# EAGLE design HFT-ArduinoShield-Module_1V1 (EAGLE 7.7.0)
Assembly variants: BAT-Charger_by_MCU

## Sheet 1 of 4: Arduino Uno socket
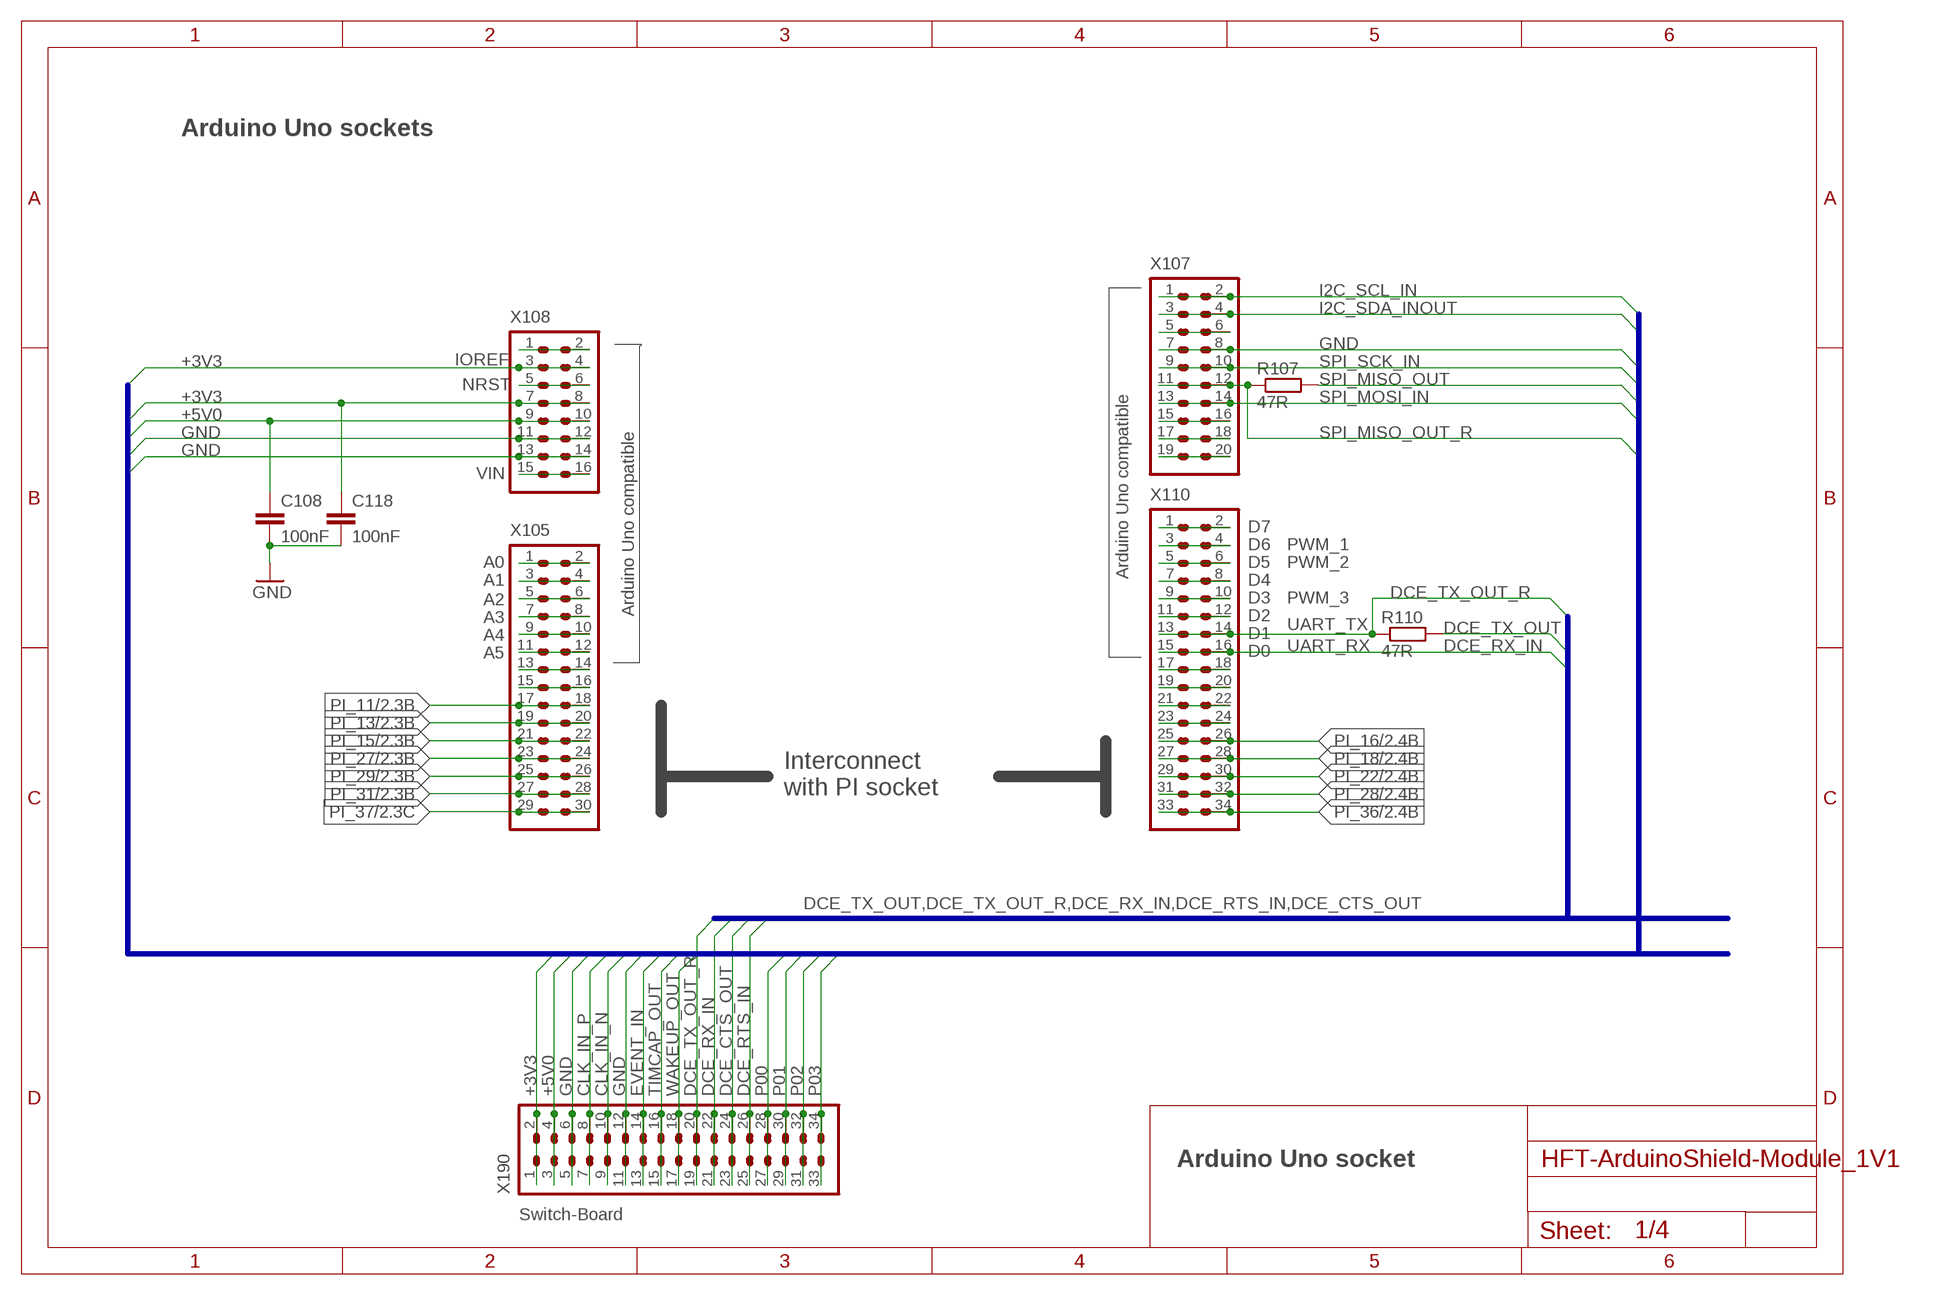
[diagram p0: schematic, sheet 1]

### Parts
C108  100nF  C-EUC0603  [C0603]
C118  100nF  C-EUC0603  [C0603]
R107  47R  R-EU_R0603  [R0603]
R110  47R  R-EU_R0603  [R0603]
X105  2X15_2MM56_SOCKET  [2X15]
X107  2X10_2MM56_SOCKET  [2X10]
X108  2X08_2MM56_SOCKET  [2X08]
X110  2X17_2MM56_SOCKET  [2X17]
X190  2X17_2MM56_SOCKET  [2X17]

### Nets
+3V3 [power]: C118.1 X108.3 X108.4 X108.7 X108.8 X190.1 X190.2 ; also sheet 2,3
+5V0 [power]: C108.1 X108.9 X108.10 X190.3 X190.4 ; also sheet 2,3
CLK_IN_N [bus]: X190.9 X190.10 ; also sheet 2,3
CLK_IN_P [bus]: X190.7 X190.8 ; also sheet 2,3
DCE_CTS_OUT: X190.23 X190.24 ; also sheet 3
DCE_RTS_IN: X190.25 X190.26 ; also sheet 3
DCE_RX_IN: X110.15 X110.16 X190.21 X190.22 ; also sheet 2,3
DCE_TX_OUT: R110.2 ; also sheet 3
DCE_TX_OUT_R: R110.1 X110.13 X110.14 X190.19 X190.20 ; also sheet 2
EVENT_IN: X190.13 X190.14 ; also sheet 3
GND: C108.2 C118.2 X107.7 X107.8 X108.11 X108.12 X108.13 X108.14 X190.5 X190.6 X190.11 X190.12 ; also sheet 2,3,4
I2C_SCL_IN: X107.1 X107.2 ; also sheet 2,3
I2C_SDA_INOUT: X107.3 X107.4 ; also sheet 2,3
N105_01: X105.1 X105.2
N105_03: X105.3 X105.4
N105_05: X105.5 X105.6
N105_07: X105.7 X105.8
N105_09: X105.9 X105.10
N105_11: X105.11 X105.12
N105_13: X105.13 X105.14
N105_15: X105.15 X105.16
N107_05: X107.5 X107.6
N107_15: X107.15 X107.16
N107_17: X107.17 X107.18
N107_19: X107.19 X107.20
N108_01: X108.1 X108.2
N108_05: X108.5 X108.6
N108_15: X108.15 X108.16
N110_01: X110.1 X110.2
N110_03: X110.3 X110.4
N110_05: X110.5 X110.6
N110_07: X110.7 X110.8
N110_09: X110.9 X110.10
N110_11: X110.11 X110.12
N110_17: X110.17 X110.18
N110_19: X110.19 X110.20
N110_21: X110.21 X110.22
N110_23: X110.23 X110.24
P00: X190.27 X190.28 ; also sheet 2,3
P01: X190.29 X190.30 ; also sheet 2,3
P02: X190.31 X190.32 ; also sheet 2,3
P03: X190.33 X190.34 ; also sheet 2,3
PI_11: X105.17 X105.18 ; also sheet 2
PI_13: X105.19 X105.20 ; also sheet 2
PI_15: X105.21 X105.22 ; also sheet 2
PI_16: X110.25 X110.26 ; also sheet 2
PI_18: X110.27 X110.28 ; also sheet 2
PI_22: X110.29 X110.30 ; also sheet 2
PI_27: X105.23 X105.24 ; also sheet 2
PI_28: X110.31 X110.32 ; also sheet 2
PI_29: X105.25 X105.26 ; also sheet 2
PI_31: X105.27 X105.28 ; also sheet 2
PI_36: X110.33 X110.34 ; also sheet 2
PI_37: X105.29 X105.30 ; also sheet 2
SPI_MISO_OUT: R107.2 ; also sheet 3
SPI_MISO_OUT_R: R107.1 X107.11 X107.12 ; also sheet 2
SPI_MOSI_IN: X107.13 X107.14 ; also sheet 2,3
SPI_SCK_IN: X107.9 X107.10 ; also sheet 2,3
TIMCAP_OUT: X190.15 X190.16 ; also sheet 3
WAKEUP_OUT: X190.17 X190.18 ; also sheet 3

### Buses
GND,+3V3,+5V0,CLK_IN_P,CLK_IN_N,EVENT_IN,WAKEUP_OUT,TIMCAP_OUT,I2C_SCL_IN,I2C_SDA_INOUT,SPI_SCK_IN,SPI_MOSI_IN,SPI_MISO_OUT,SPI_MISO_OUT_R,I2S_A_SCK_IN,I2S_A_SD_IN,I2S_A_MCLK_IN,I2S_A_FS_IN,I2S_B_SCK_OUT,I2S_B_SD_OUT,I2S_B_FS_OUT,P00,P01,P02,P03
DCE_TX_OUT,DCE_TX_OUT_R,DCE_RX_IN,DCE_RTS_IN,DCE_CTS_OUT

### Notes on the sheet
- Arduino Uno sockets
- IOREF
- NRST
- VIN
- D7
- D6 | PWM_1
- A0 | D5 | PWM_2
- Arduino Uno compatible
- A1 | D4
- A2 | D3 | PWM_3
- Arduino Uno compatible
- A3 | D2
- UART_TX
- A4 | D1
- UART_RX
- A5 | D0
- Interconnect
  with PI socket
- Arduino Uno socket
- Switch-Board

## Sheet 2 of 4: Raspberry Pi connector
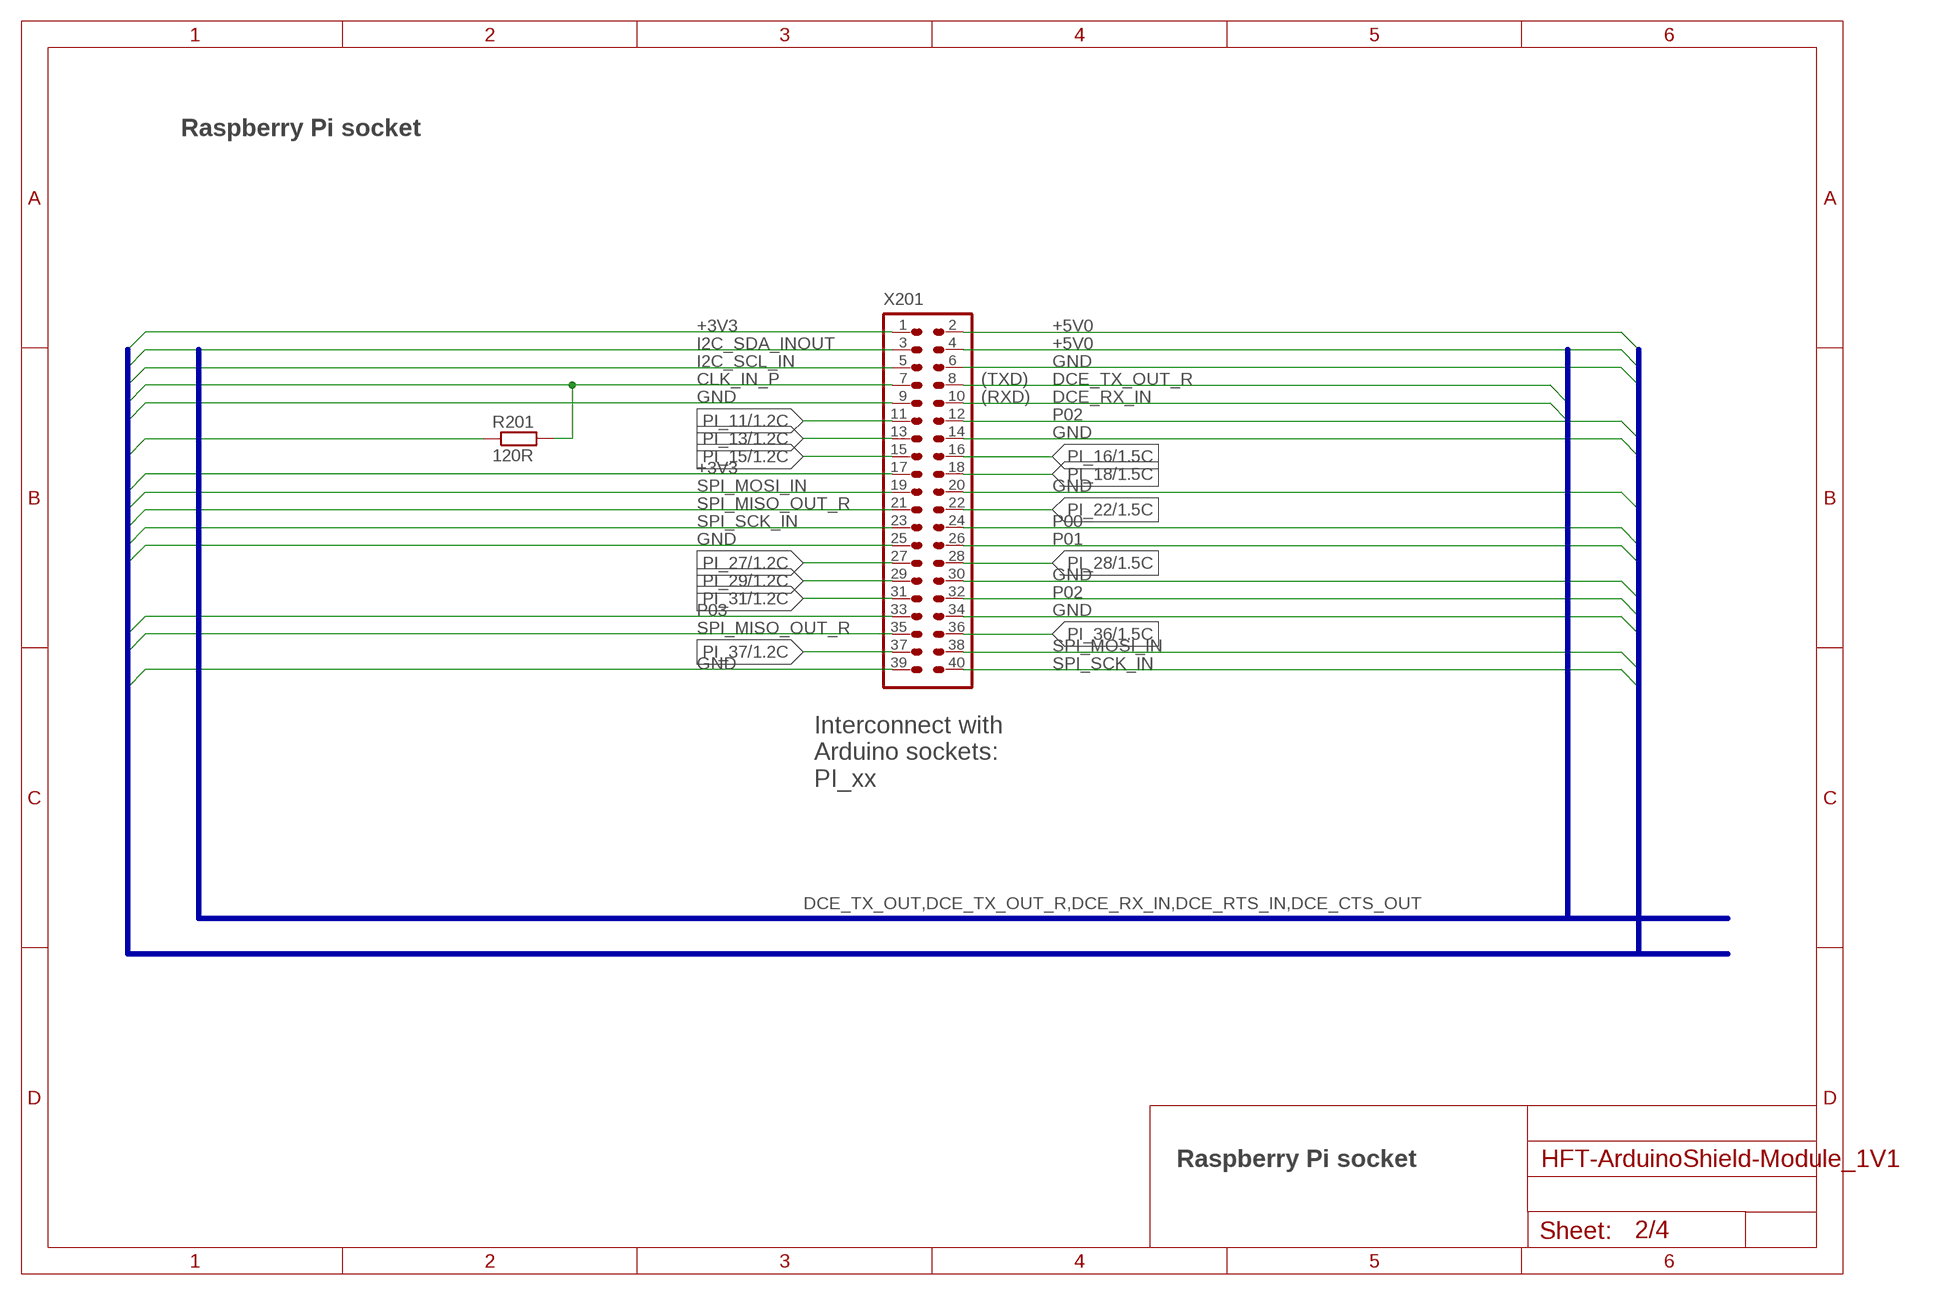
[diagram p1: schematic, sheet 2]

### Parts
R201  120R  R-EU_R0603  [R0603]
X201  2X20_2MM56_SOCKET  [2X20]

### Nets
+3V3 [power]: X201.1 X201.17 ; also sheet 1,3
+5V0 [power]: X201.2 X201.4 ; also sheet 1,3
CLK_IN_N [bus]: R201.1 ; also sheet 1,3
CLK_IN_P [bus]: R201.2 X201.7 ; also sheet 1,3
DCE_RX_IN: X201.10 ; also sheet 1,3
DCE_TX_OUT_R: X201.8 ; also sheet 1
GND: X201.6 X201.9 X201.14 X201.20 X201.25 X201.30 X201.34 X201.39 ; also sheet 1,3,4
I2C_SCL_IN: X201.5 ; also sheet 1,3
I2C_SDA_INOUT: X201.3 ; also sheet 1,3
P00: X201.24 ; also sheet 1,3
P01: X201.26 ; also sheet 1,3
P02: X201.12 X201.32 ; also sheet 1,3
P03: X201.33 ; also sheet 1,3
PI_11: X201.11 ; also sheet 1
PI_13: X201.13 ; also sheet 1
PI_15: X201.15 ; also sheet 1
PI_16: X201.16 ; also sheet 1
PI_18: X201.18 ; also sheet 1
PI_22: X201.22 ; also sheet 1
PI_27: X201.27 ; also sheet 1
PI_28: X201.28 ; also sheet 1
PI_29: X201.29 ; also sheet 1
PI_31: X201.31 ; also sheet 1
PI_36: X201.36 ; also sheet 1
PI_37: X201.37 ; also sheet 1
SPI_MISO_OUT_R: X201.21 X201.35 ; also sheet 1
SPI_MOSI_IN: X201.19 X201.38 ; also sheet 1,3
SPI_SCK_IN: X201.23 X201.40 ; also sheet 1,3

### Buses
GND,+3V3,+5V0,CLK_IN_P,CLK_IN_N,EVENT_IN,WAKEUP_OUT,TIMCAP_OUT,I2C_SCL_IN,I2C_SDA_INOUT,SPI_SCK_IN,SPI_MOSI_IN,SPI_MISO_OUT,SPI_MISO_OUT_R,I2S_A_SCK_IN,I2S_A_SD_IN,I2S_A_MCLK_IN,I2S_A_FS_IN,I2S_B_SCK_OUT,I2S_B_SD_OUT,I2S_B_FS_OUT,P00,P01,P02,P03
DCE_TX_OUT,DCE_TX_OUT_R,DCE_RX_IN,DCE_RTS_IN,DCE_CTS_OUT

### Notes on the sheet
- Raspberry Pi socket
- (TXD)
- (RXD)
- Interconnect with
  Arduino sockets:
  PI_xx
- Raspberry Pi socket

## Sheet 3 of 4: Connectors
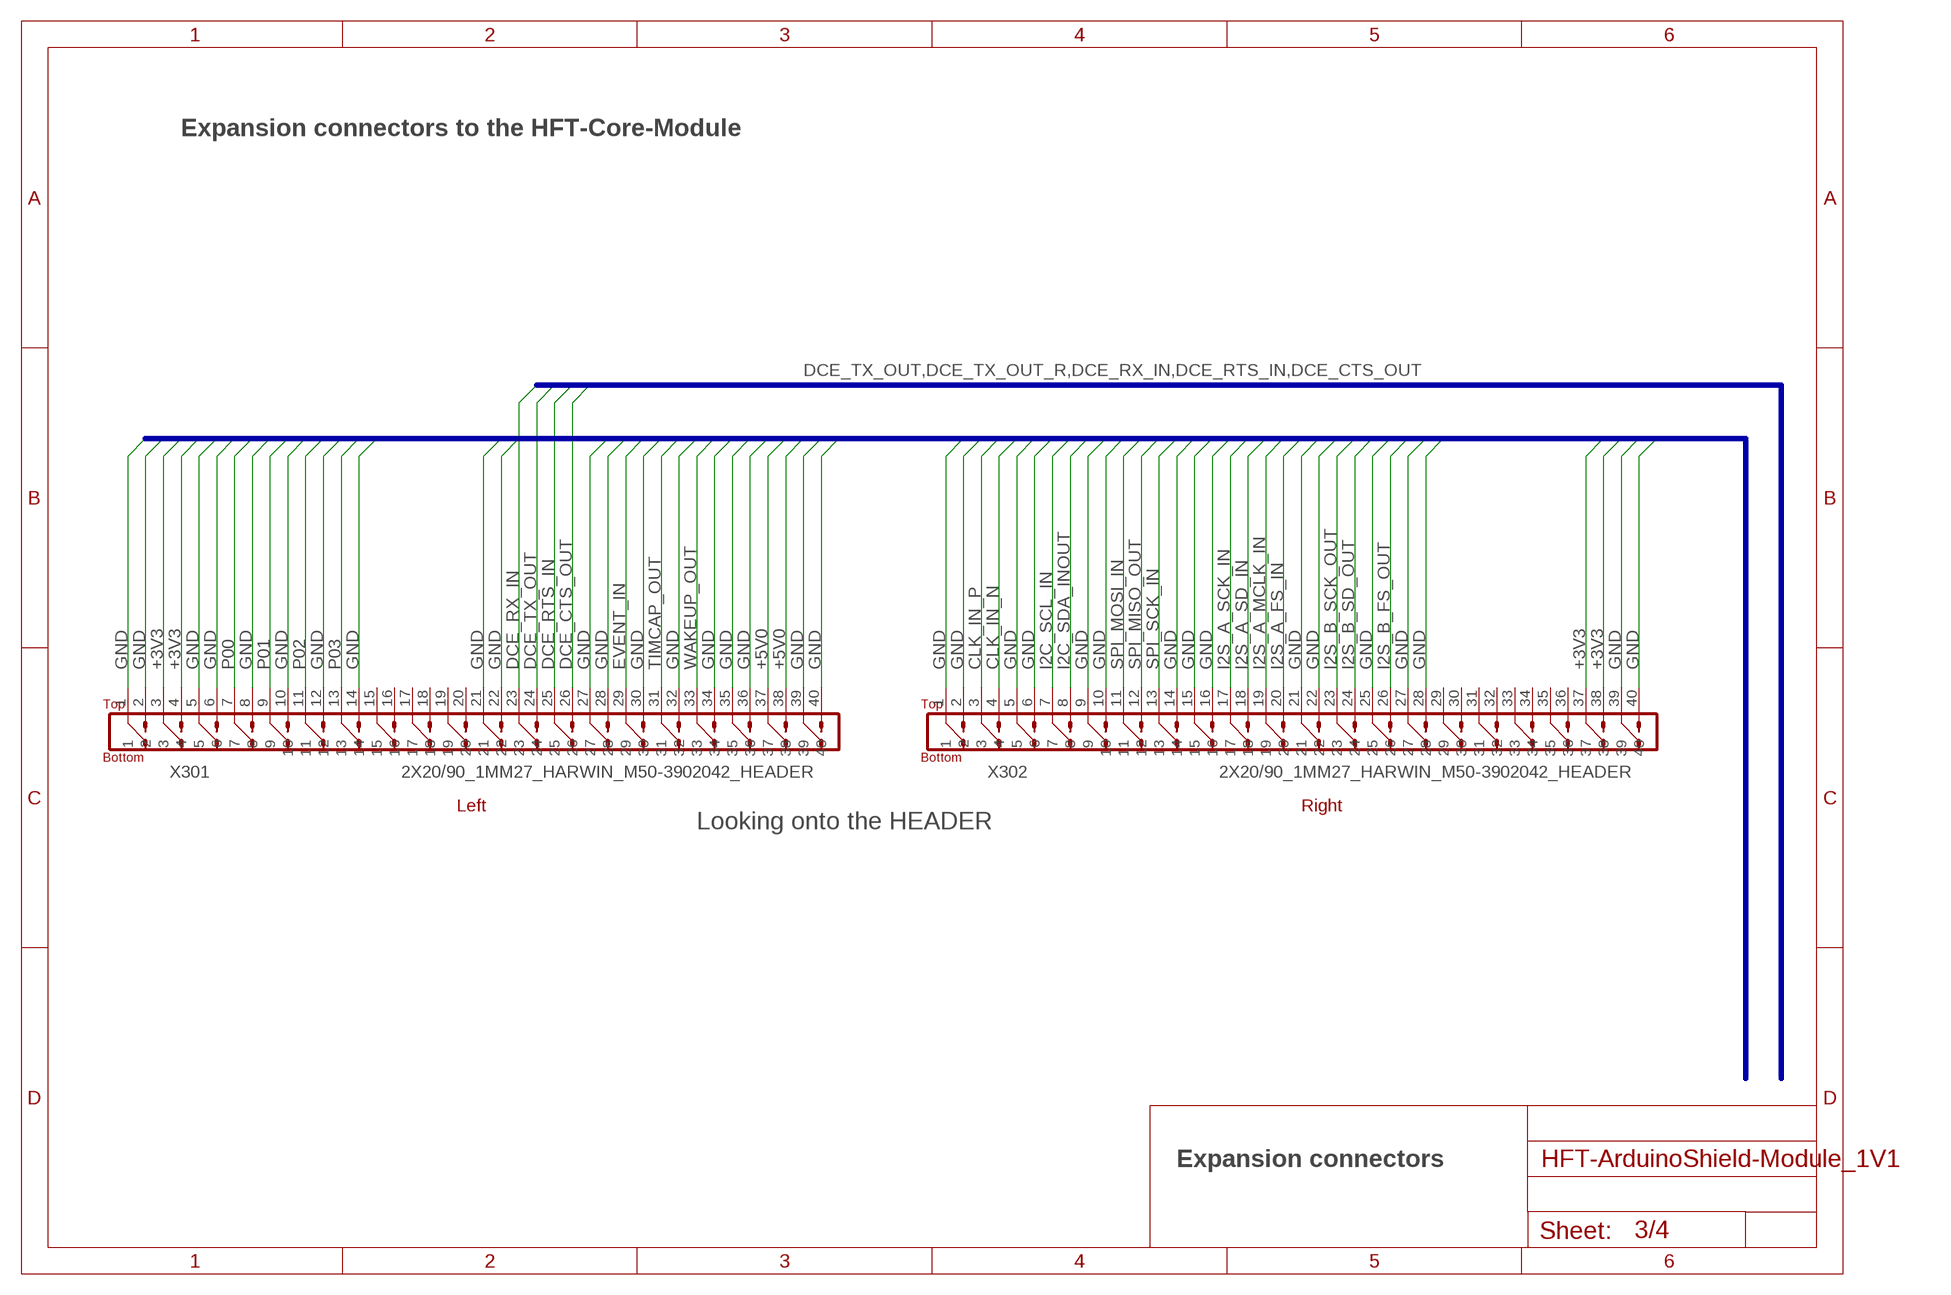
[diagram p2: schematic, sheet 3]

### Parts
X301  2X20/90_1MM27_HARWIN_M50-3902042_HEADER  [2X20/90_1MM27_HARWIN_M50-3902042_HEADER]
X302  2X20/90_1MM27_HARWIN_M50-3902042_HEADER  [2X20/90_1MM27_HARWIN_M50-3902042_HEADER]

### Nets
+3V3 [power]: X301.3 X301.4 X302.37 X302.38 ; also sheet 1,2
+5V0 [power]: X301.37 X301.38 ; also sheet 1,2
CLK_IN_N [bus]: X302.4 ; also sheet 1,2
CLK_IN_P [bus]: X302.3 ; also sheet 1,2
DCE_CTS_OUT: X301.26 ; also sheet 1
DCE_RTS_IN: X301.25 ; also sheet 1
DCE_RX_IN: X301.23 ; also sheet 1,2
DCE_TX_OUT: X301.24 ; also sheet 1
EVENT_IN: X301.29 ; also sheet 1
GND: X301.1 X301.2 X301.5 X301.6 X301.8 X301.10 X301.12 X301.14 X301.21 X301.22 X301.27 X301.28 X301.30 X301.32 X301.34 X301.35 X301.36 X301.39 X301.40 X302.1 X302.2 X302.5 X302.6 X302.9 X302.10 X302.14 X302.15 X302.16 X302.21 X302.22 X302.25 X302.27 X302.28 X302.39 X302.40 ; also sheet 1,2,4
I2C_SCL_IN: X302.7 ; also sheet 1,2
I2C_SDA_INOUT: X302.8 ; also sheet 1,2
I2S_A_FS_IN: X302.20
I2S_A_MCLK_IN: X302.19
I2S_A_SCK_IN: X302.17
I2S_A_SD_IN: X302.18
I2S_B_FS_OUT: X302.26
I2S_B_SCK_OUT: X302.23
I2S_B_SD_OUT: X302.24
P00: X301.7 ; also sheet 1,2
P01: X301.9 ; also sheet 1,2
P02: X301.11 ; also sheet 1,2
P03: X301.13 ; also sheet 1,2
SPI_MISO_OUT: X302.12 ; also sheet 1
SPI_MOSI_IN: X302.11 ; also sheet 1,2
SPI_SCK_IN: X302.13 ; also sheet 1,2
TIMCAP_OUT: X301.31 ; also sheet 1
WAKEUP_OUT: X301.33 ; also sheet 1
Unconnected: X301.15 X301.16 X301.17 X301.18 X301.19 X301.20 X302.29 X302.30 X302.31 X302.32 X302.33 X302.34 X302.35 X302.36

### Buses
GND,+3V3,+5V0,CLK_IN_P,CLK_IN_N,EVENT_IN,WAKEUP_OUT,TIMCAP_OUT,I2C_SCL_IN,I2C_SDA_INOUT,SPI_SCK_IN,SPI_MOSI_IN,SPI_MISO_OUT,SPI_MISO_OUT_R,I2S_A_SCK_IN,I2S_A_SD_IN,I2S_A_MCLK_IN,I2S_A_FS_IN,I2S_B_SCK_OUT,I2S_B_SD_OUT,I2S_B_FS_OUT,P00,P01,P02,P03
DCE_TX_OUT,DCE_TX_OUT_R,DCE_RX_IN,DCE_RTS_IN,DCE_CTS_OUT

### Notes on the sheet
- Expansion connectors to the HFT-Core-Module
- Left | Right
- Looking onto the HEADER
- Expansion connectors

## Sheet 4 of 4: Holes
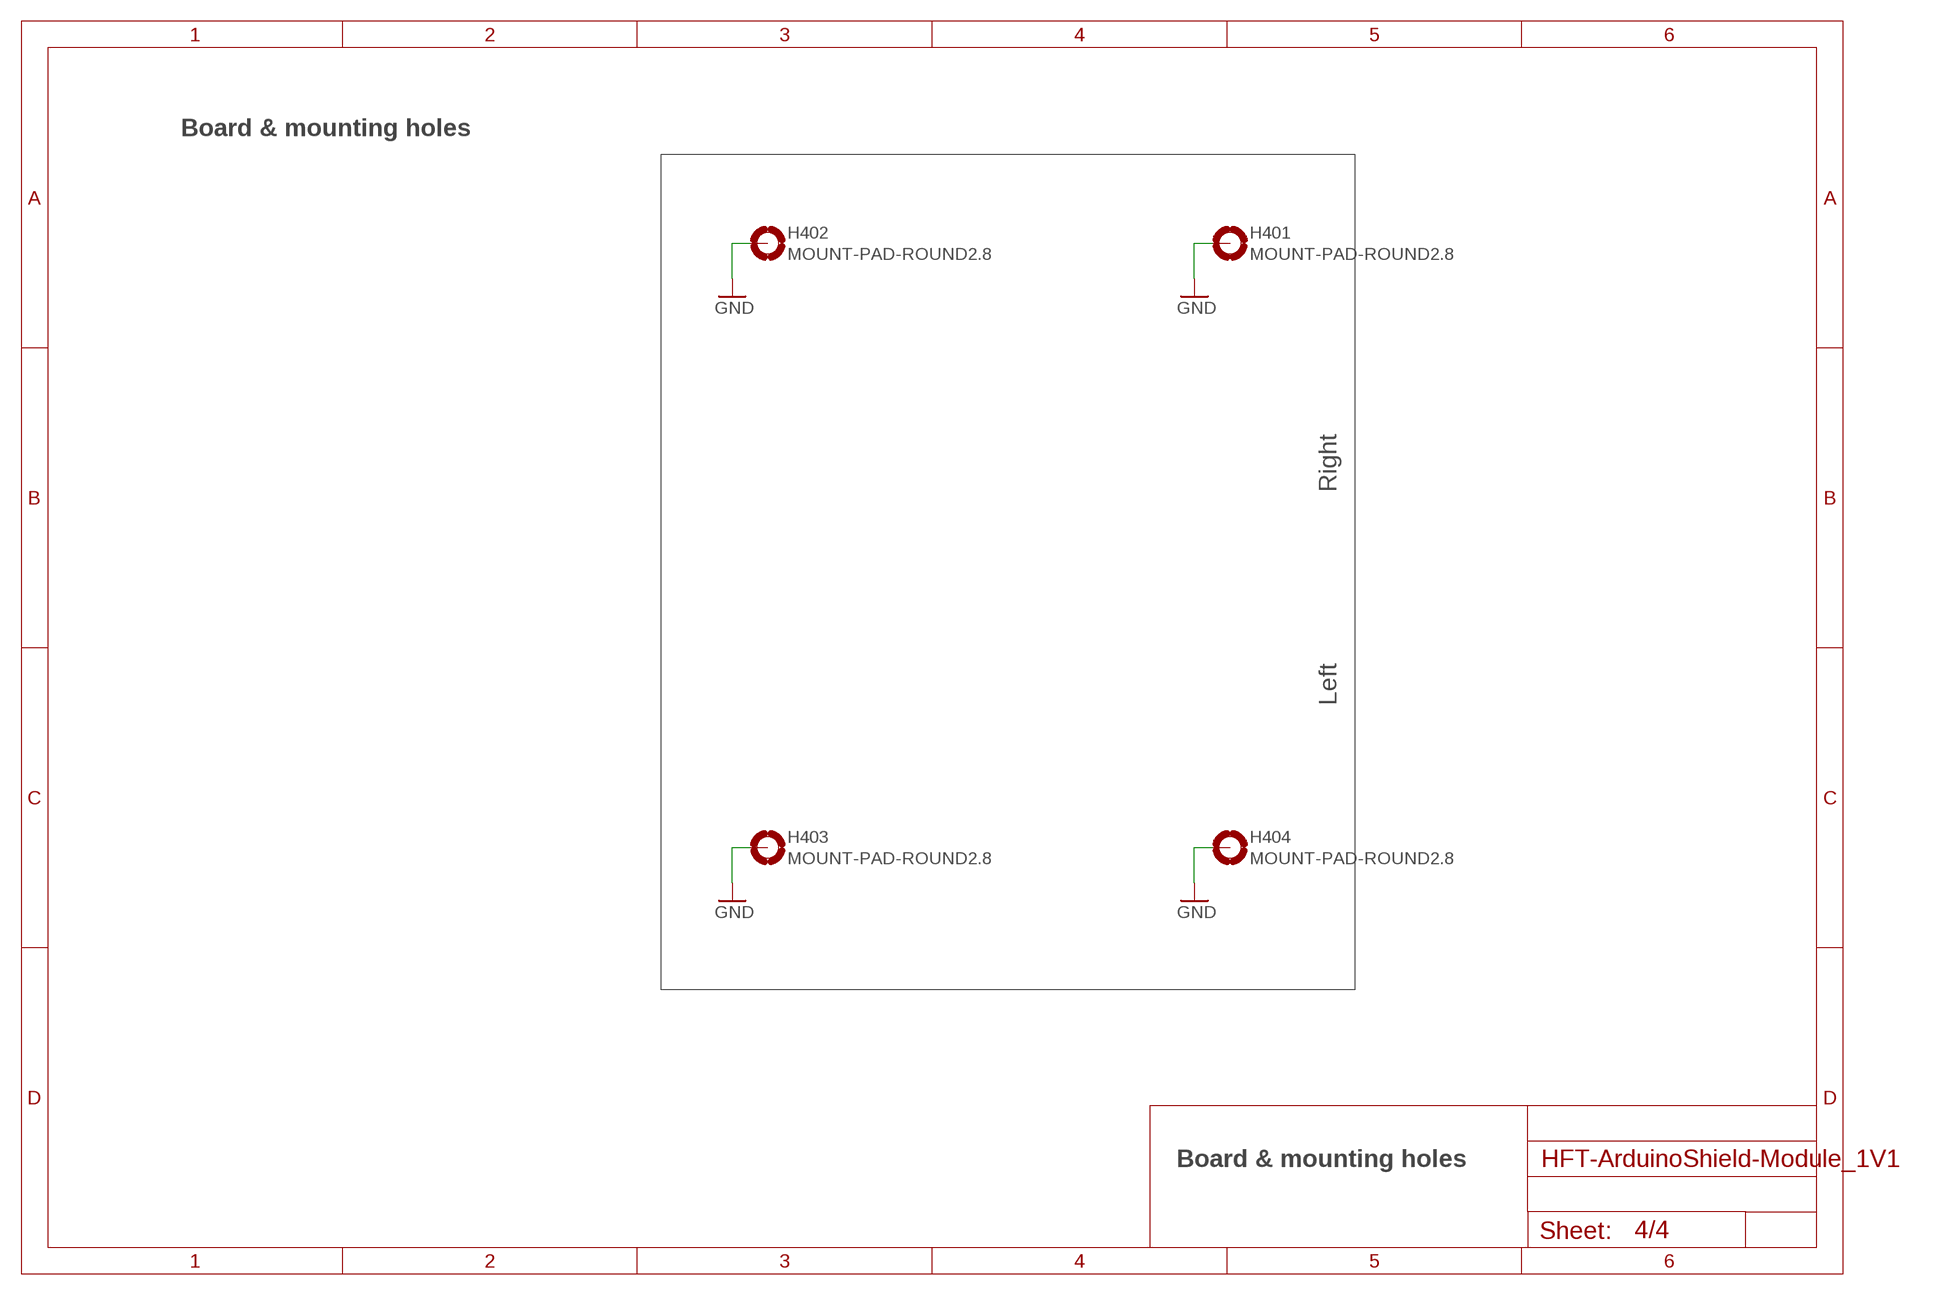
[diagram p3: schematic, sheet 4]

### Parts
H401  MOUNT-PAD-ROUND2.8  [2,8-PAD]
H402  MOUNT-PAD-ROUND2.8  [2,8-PAD]
H403  MOUNT-PAD-ROUND2.8  [2,8-PAD]
H404  MOUNT-PAD-ROUND2.8  [2,8-PAD]

### Nets
GND: H401.B2,8(MOUNT) H402.B2,8(MOUNT) H403.B2,8(MOUNT) H404.B2,8(MOUNT) ; also sheet 1,2,3

### Notes on the sheet
- Board & mounting holes
- Right
- Left
- Board & mounting holes

## Library data of the parts
C108 C118 = df4iah_rcl:C-EU: CAPACITOR, European symbol
H401-H404 = holes:MOUNT-PAD-ROUND: MOUNTING PAD, round
R107 R110 R201 = df4iah_rcl:R-EU_: RESISTOR, European symbol
X105 = df4iah_connector:2X15_2MM56_SOCKET: Header 2X15 2.54mm
X107 = df4iah_connector:2X10_2MM56_SOCKET: Header 2X10 2.54mm
X108 = df4iah_connector:2X08_2MM56_SOCKET: Header 2X08 2.54mm
X110 X190 = df4iah_connector:2X17_2MM56_SOCKET: Header 2X17 2.54mm
X201 = df4iah_connector:2X20_2MM56_SOCKET: Header 2X20 2.54mm
X301 X302 = df4iah_connector:2X20/90_1MM27_HARWIN_M50-3902042_HEADER: Header 20X2 1.27mm M50-3902042 Archer, 90°

## Net classes
1 power: width 0.5 mm
2 bus: clearance 0.6 mm

## Board
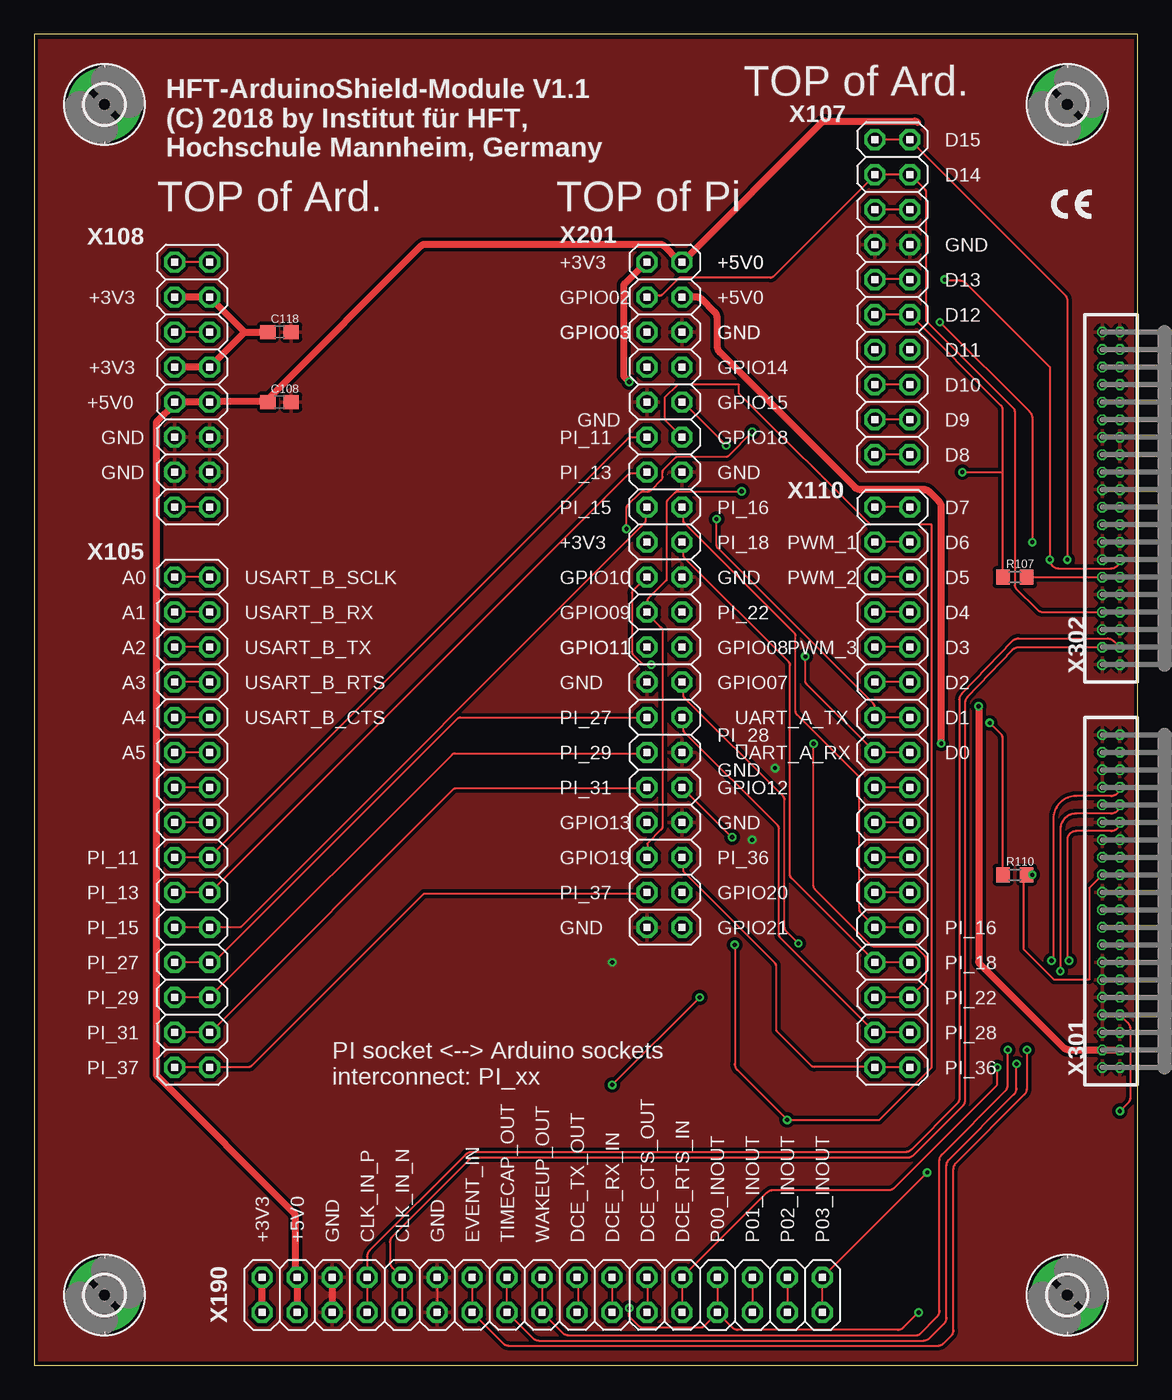
[diagram p4: board, top side]
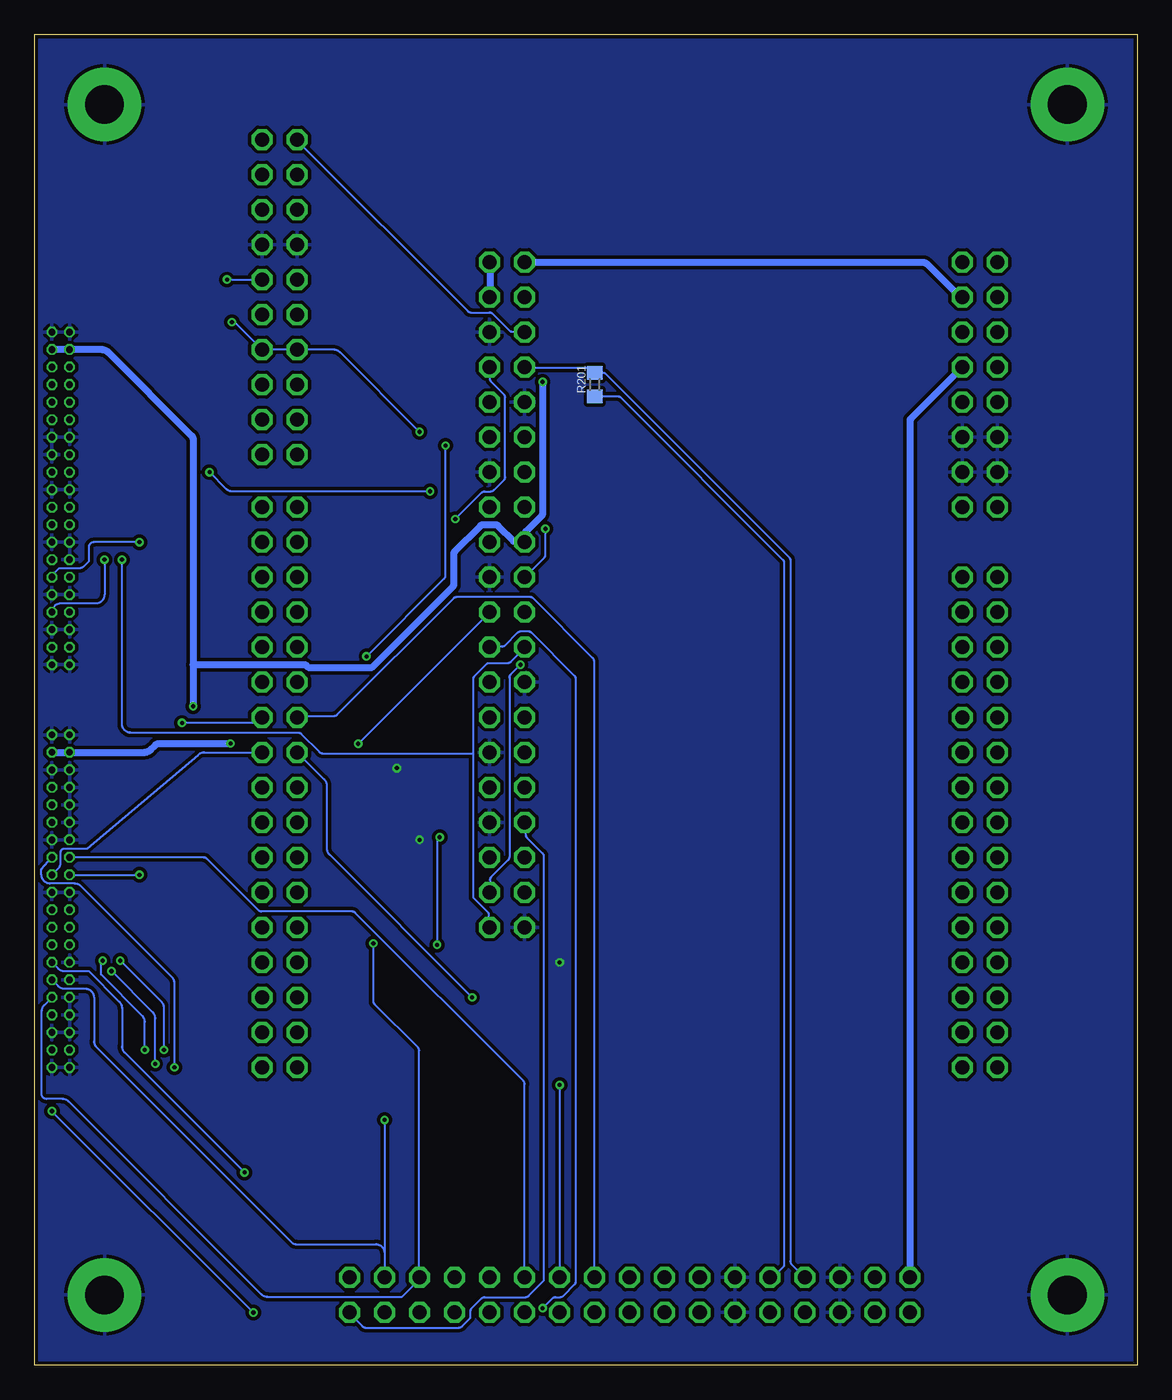
[diagram p5: board, bottom side, seen from below]

Size 80.01 x 96.52 mm. Coordinates in mm from the lower left corner, seen from the top.
Outline: 0,0 80.01,0 80.01,96.52 0,96.52 0,0
Copper layers ((1*2)+(15*16)): Top 0.035mm / dielectric 0.65mm / Route2 0.035mm / dielectric 0.65mm / Route15 0.035mm / dielectric 0.65mm / Bottom 0.035mm
Design rules "DirtyPCBs_4layers_6mil_20150401 *": minimum track width 6mil, minimum drill 12mil, track to track 0.25mm, track to pad 0.25mm, pad to pad 6mil, via to via 6mil, smd to smd 0mil, copper to edge 10mil, drill to drill 10mil, minimum pad ring 5mil, minimum via ring 6mil, stop-mask expansion 2mil, vias tented up to drill 25mil, thermal gap 10mil

### Footprints (pad centres in the part's own frame; a part is rotated, then mirrored left to right if it is on the bottom)
C0603 = smd 1.1 x 1: 1 -0.85,0; 2 0.85,0
2,8-PAD = drill 2.8 pad 5.334: B2,8 0,0
R0603 = smd 1 x 1.1: 1 -0.85,0; 2 0.85,0
2X15 = drill 1.016 octagon: 1 -19.05,-1.27; 2 -19.05,1.27; 3 -16.51,-1.27; 4 -16.51,1.27; 5 -13.97,-1.27; 6 -13.97,1.27; 7 -11.43,-1.27; 8 -11.43,1.27; 9 -8.89,-1.27; 10 -8.89,1.27; 11 -6.35,-1.27; 12 -6.35,1.27; 13 -3.81,-1.27; 14 -3.81,1.27; 15 -1.27,-1.27; 16 -1.27,1.27; 17 1.27,-1.27; 18 1.27,1.27; 19 3.81,-1.27; 20 3.81,1.27; 21 6.35,-1.27; 22 6.35,1.27; 23 8.89,-1.27; 24 8.89,1.27; 25 11.43,-1.27; 26 11.43,1.27; 27 13.97,-1.27; 28 13.97,1.27; 29 16.51,-1.27; 30 16.51,1.27
2X10 = drill 1.016 octagon: 1 -11.43,-1.27; 2 -11.43,1.27; 3 -8.89,-1.27; 4 -8.89,1.27; 5 -6.35,-1.27; 6 -6.35,1.27; 7 -3.81,-1.27; 8 -3.81,1.27; 9 -1.27,-1.27; 10 -1.27,1.27; 11 1.27,-1.27; 12 1.27,1.27; 13 3.81,-1.27; 14 3.81,1.27; 15 6.35,-1.27; 16 6.35,1.27; 17 8.89,-1.27; 18 8.89,1.27; 19 11.43,-1.27; 20 11.43,1.27
2X08 = drill 1.016 octagon: 1 -8.89,-1.27; 2 -8.89,1.27; 3 -6.35,-1.27; 4 -6.35,1.27; 5 -3.81,-1.27; 6 -3.81,1.27; 7 -1.27,-1.27; 8 -1.27,1.27; 9 1.27,-1.27; 10 1.27,1.27; 11 3.81,-1.27; 12 3.81,1.27; 13 6.35,-1.27; 14 6.35,1.27; 15 8.89,-1.27; 16 8.89,1.27
2X17 = drill 1.016 octagon: 1 -21.59,-1.27; 2 -21.59,1.27; 3 -19.05,-1.27; 4 -19.05,1.27; 5 -16.51,-1.27; 6 -16.51,1.27; 7 -13.97,-1.27; 8 -13.97,1.27; 9 -11.43,-1.27; 10 -11.43,1.27; 11 -8.89,-1.27; 12 -8.89,1.27; 13 -6.35,-1.27; 14 -6.35,1.27; 15 -3.81,-1.27; 16 -3.81,1.27; 17 -1.27,-1.27; 18 -1.27,1.27; 19 1.27,-1.27; 20 1.27,1.27; 21 3.81,-1.27; 22 3.81,1.27; 23 6.35,-1.27; 24 6.35,1.27; 25 8.89,-1.27; 26 8.89,1.27; 27 11.43,-1.27; 28 11.43,1.27; 29 13.97,-1.27; 30 13.97,1.27; 31 16.51,-1.27; 32 16.51,1.27; 33 19.05,-1.27; 34 19.05,1.27
2X20 = drill 1.016 octagon: 1 -22.86,-1.27; 2 -22.86,1.27; 3 -20.32,-1.27; 4 -20.32,1.27; 5 -17.78,-1.27; 6 -17.78,1.27; 7 -15.24,-1.27; 8 -15.24,1.27; 9 -12.7,-1.27; 10 -12.7,1.27; 11 -10.16,-1.27; 12 -10.16,1.27; 13 -7.62,-1.27; 14 -7.62,1.27; 15 -5.08,-1.27; 16 -5.08,1.27; 17 -2.54,-1.27; 18 -2.54,1.27; 19 0,-1.27; 20 0,1.27; 21 2.54,-1.27; 22 2.54,1.27; 23 5.08,-1.27; 24 5.08,1.27; 25 7.62,-1.27; 26 7.62,1.27; 27 10.16,-1.27; 28 10.16,1.27; 29 12.7,-1.27; 30 12.7,1.27; 31 15.24,-1.27; 32 15.24,1.27; 33 17.78,-1.27; 34 17.78,1.27; 35 20.32,-1.27; 36 20.32,1.27; 37 22.86,-1.27; 38 22.86,1.27; 39 25.4,-1.27; 40 25.4,1.27
2X20/90_1MM27_HARWIN_M50-3902042_HEADER = drill 0.5 pad 0.762 octagon: 1 -11.43,0; 2 -11.43,1.27; 3 -10.16,0; 4 -10.16,1.27; 5 -8.89,0; 6 -8.89,1.27; 7 -7.62,0; 8 -7.62,1.27; 9 -6.35,0; 10 -6.35,1.27; 11 -5.08,0; 12 -5.08,1.27; 13 -3.81,0; 14 -3.81,1.27; 15 -2.54,0; 16 -2.54,1.27; 17 -1.27,0; 18 -1.27,1.27; 19 0,0; 20 0,1.27; 21 1.27,0; 22 1.27,1.27; 23 2.54,0; 24 2.54,1.27; 25 3.81,0; 26 3.81,1.27; 27 5.08,0; 28 5.08,1.27; 29 6.35,0; 30 6.35,1.27; 31 7.62,0; 32 7.62,1.27; 33 8.89,0; 34 8.89,1.27; 35 10.16,0; 36 10.16,1.27; 37 11.43,0; 38 11.43,1.27; 39 12.7,0; 40 12.7,1.27

### Placement (x,y rotation side)
C108  17.78,69.85 0 top
C118  17.78,74.93 0 top
H401  74.93,91.44 0 top
H402  5.08,91.44 0 top
H403  5.08,5.08 0 top
H404  74.93,5.08 0 top
R107  71.12,57.15 0 top
R110  71.12,35.56 0 top
R201  39.37,71.12 90 bottom
X105  11.43,38.1 270 top
X107  62.23,77.47 270 top
X108  11.43,71.12 270 top
X110  62.23,40.64 270 top
X190  38.1,5.08 0 top
X201  45.72,57.15 270 top
X301  78.74,33.02 90 top
X302  78.74,62.23 90 top

### Tracks (layer width: path | path; a pad name or v marks a point on that pad's centre or on a via)
+3V3  (via drill 0.3)
  Top 0.5: X108.7 X108.8 15.24,74.93 | 15.24,74.93 C118.1 | 15.24,74.93 X108.4 X108.3 | X190.1 16.49,3.82 16.49,6.14 X190.2 | v68.5,47.78 68.5,29.31 arc45 68.59,29.08 74.62,23.05 arc45 75.07,22.86 X301.4 X301.3 | v43.15,71.33 42.84,71.64 arc-45 42.74,71.86 42.74,78.24 arc-45 42.84,78.46 44.35,79.98 X201.1
  Bottom 0.5: 12.77,77.46 X108.4 12.97,77.56 15.29,79.88 arc-45 15.51,79.98 44.35,79.98 X201.1 | 68.5,50.8 68.5,67.17 arc-45 68.59,67.39 74.67,73.47 arc-45 75.12,73.66 X302.38 X302.37 | 68.5,50.8 v68.5,47.78 | 68.5,50.8 60.35,50.8 60.15,50.6 55.52,50.6 49.68,56.44 arc-45 49.58,56.67 49.58,58.82 arc45 49.49,59.05 47.66,60.87 arc45 47.44,60.96 46.6,60.96 arc45 46.37,60.87 45.26,59.76 44.45,59.76 X201.17 44.35,59.96 44.35,60.46 43.24,61.58 arc-45 43.15,61.8 v43.15,71.33 | X190.2 16.49,6.44 16.49,68.48 arc45 16.39,68.7 12.77,72.33 X108.8
+5V0  (via drill 0.3)
  Top 0.5: X190.3 X190.4 18.9,6.54 18.9,10.83 arc45 18.81,11.06 8.93,20.93 arc-45 8.84,21.16 8.84,68.28 arc-45 8.93,68.5 10.05,69.61 X108.9 X108.10 12.87,69.92 16.89,69.92 C108.1 16.99,70.12 28.06,81.19 arc-45 28.29,81.28 45.43,81.28 arc-45 45.65,81.19 46.77,80.08 X201.2 47.07,80.08 57.14,90.14 arc-45 57.36,90.24 63.84,90.24 arc-45 64.06,90.14 | v65.79,45.09 65.79,62.22 arc45 65.6,62.67 64.96,63.31 arc45 64.51,63.5 59.95,63.5 arc-45 59.5,63.69 49.72,73.47 arc-45 49.53,73.92 49.53,75.94 arc45 49.34,76.39 48.45,77.28 arc45 48,77.47 X201.4
  Bottom 0.5: X201.4 46.97,77.56 46.97,79.98 X201.2 | X301.37 X301.38 72.02,44.45 arc-45 71.57,44.64 71.25,44.96 arc45 70.94,45.09 v65.79,45.09
CLK_IN_N
  Top 0.152: X190.9 X190.10 25.97,7.05 arc-45 25.78,7.5 25.78,8.88 arc-45 25.97,9.33 31.49,14.85 arc-45 31.94,15.04 63.32,15.04 arc45 63.77,15.22 67.33,18.78 arc45 67.51,19.23 67.51,48.01 arc-43 67.69,48.44 70.93,51.87 arc-47 71.39,52.07 X302.4
  Bottom 0.152: R201.1 37.67,70.27 arc45 37.5,70.2 25.7,58.4 arc45 25.63,58.22 25.63,7.3 arc45 25.72,7.08 26.4,6.39 | 26.4,6.39 26.44,6.35 | 26.4,6.39 26.45,6.44 26.65,6.44 X190.10
CLK_IN_P
  Top 0.152: X190.7 24.13,3.82 24.13,6.34 X190.8 24.13,7.87 arc-45 24.32,8.31 31.26,15.26 arc-45 31.71,15.44 63.15,15.44 arc45 63.6,15.63 66.92,18.95 arc45 67.11,19.4 67.11,48.26 arc-44 67.28,48.7 70.93,52.51 arc-46 71.39,52.7 77.84,52.7 arc-45 78.29,52.52 X302.3
  Bottom 0.152: X190.8 25.08,7.3 arc45 25.17,7.53 25.17,58.41 arc-45 25.25,58.59 38.54,71.88 arc-45 38.76,71.97 R201.2 39.42,72.03 39.73,72.33 44.35,72.33 X201.7
DCE_CTS_OUT
  Top 0.152: X190.23 44.45,3.82 44.45,6.34 X190.24
  Bottom 0.152: X190.24 44.45,6.44 44.45,20.39 arc-45 44.55,20.61 56.73,32.8 arc-45 56.96,32.9 63.54,32.9 arc45 63.76,32.99 67.5,36.73 arc-45 67.72,36.82 arc-90 67.73,36.83 X301.26
DCE_RTS_IN  (via drill 0.3)
  Top 0.152: X190.25 X190.26 53.15,12.51 arc-45 53.6,12.7 61.97,12.7 arc45 62.42,12.89 69.85,20.32 v69.85,21.59
  Bottom 0.152: v69.85,21.59 69.85,27.68 arc-45 70.04,28.13 76.65,34.74 arc-45 77.1,34.92 78.87,34.92 arc90 79.5,35.56 79.5,35.94 X301.25
DCE_RX_IN  (via drill 0.3)
  Top 0.152: X190.22 X190.21 | X110.16 X110.15 60.95,44.47 56.02,49.4 arc-45 55.92,49.63 v55.92,51.41 | v50.19,66.7 47.07,69.82 X201.10 | v48.26,26.67 v41.91,20.32
  Bottom 0.152: v55.92,51.41 50.28,57.05 arc-45 50.19,57.27 v50.19,66.7 | X110.16 67.68,44.45 arc-45 68.13,44.26 76.2,37.47 77.84,37.47 arc-90 78.11,37.2 78.11,36.46 arc45 78.29,36.01 X301.23 | X110.15 58.99,42.48 arc45 58.8,42.03 58.8,37.47 arc-45 58.62,37.02 v48.26,26.67 | v41.91,20.32 X190.22
DCE_TX_OUT  (via drill 0.3)
  Top 0.152: 72.02,35.61 R110.2 71.75,35.56 71.75,30.16 73.98,27.94 76.52,27.94 76.52,34.61 X301.24
  Bottom 0.152: X301.24 v72.39,35.56
DCE_TX_OUT_R  (via drill 0.3)
  Top 0.152: X110.14 X110.13 60.95,47.08 60.95,47.75 arc45 60.86,47.98 49.58,59.26 arc-45 49.48,59.49 v49.48,61.37 | X190.19 39.42,3.82 39.42,6.34 X190.20 | v69.3,46.58 70.11,45.77 arc-45 70.21,45.54 70.21,35.61 R110.1
  Bottom 0.152: v69.3,46.58 63.97,46.58 63.57,46.98 X110.14 | v49.48,61.37 47.56,63.28 arc45 47.34,63.38 46.9,63.38 arc-45 46.67,63.47 45.95,64.19 arc-45 45.86,64.42 45.86,70.19 arc-45 45.95,70.41 46.88,71.33 arc45 46.97,71.56 46.97,72.33 X201.8 | X190.20 39.42,6.44 39.42,51.07 arc-45 39.52,51.3 43.86,55.64 arc-45 44.08,55.73 49.35,55.73 arc-45 49.58,55.64 58.04,47.17 arc45 58.27,47.08 60.95,47.08 X110.13
EVENT_IN  (via drill 0.3)
  Top 0.152: X190.14 31.78,6.34 31.78,3.82 X190.13 33.98,1.58 arc45 34.43,1.4 65.52,1.4 arc45 65.97,1.58 66.49,2.1 arc45 66.67,2.55 66.67,14.21 arc-45 66.86,14.66 71.82,19.63 arc45 72.01,20.07 v72.01,22.86 | X301.29 arc-90 78.11,38.73 75.56,38.73 arc90 74.93,38.1 74.93,29.21 v75.06,29.34
  Bottom 0.152: v72.01,22.86 72.01,24.88 arc-45 72.19,25.33 75.18,28.32 75.18,29.21 arc90 v75.06,29.34
GND  (via drill 0.3)
  Top 0.152: X190.12 X190.11
  Top 0.5: X190.6 X190.5
  other vias: 53.72,43.31 41.91,29.21 52.07,38.1
  pour Bottom: 0.32,96.15 79.69,96.15 79.69,0.32 0.32,0.32
  pour Top: 0.32,96.15 79.69,96.15 79.69,0.32 0.32,0.32
I2C_SCL_IN  (via drill 0.3)
  Top 0.152: X107.1 X107.2 74.74,77.66 arc-45 74.93,77.21 v74.93,58.42
  Bottom 0.152: X201.5 44.45,74.95 45.33,74.95 arc45 45.55,75.04 46.77,76.26 arc-45 47,76.36 48.35,76.36 arc45 48.57,76.45 60.95,88.83 X107.1 | v74.93,58.42 74.93,55.88 arc90 75.56,55.24 78.11,55.24 arc-90 X302.7
I2C_SDA_INOUT
  Top 0.152: X201.3 44.45,77.56 45.33,77.56 arc45 45.55,77.66 46.67,78.78 arc-45 46.9,78.87 53.38,78.87 arc45 53.6,78.96 60.95,86.31 X107.3 X107.4 63.57,86.31 64.58,85.3 arc-45 64.67,85.08 64.67,75.75 71.02,69.41 arc-45 71.11,69.18 71.11,56.57 arc45 71.21,56.34 72.75,54.8 arc45 73.2,54.61 X302.8
N105_01
  Top 0.152: X105.2 X105.1
N105_03
  Top 0.152: X105.4 X105.3
N105_05
  Top 0.152: X105.6 X105.5
N105_07
  Top 0.152: X105.8 X105.7
N105_09
  Top 0.152: X105.10 X105.9
N105_11
  Top 0.152: X105.12 X105.11
N105_13
  Top 0.152: X105.14 X105.13
N105_15
  Top 0.152: X105.16 X105.15
N107_05
  Top 0.152: X107.6 X107.5
N107_15
  Top 0.152: X107.16 X107.15
N107_17
  Top 0.152: X107.18 X107.17
N107_19
  Top 0.152: X107.20 X107.19
N108_01
  Top 0.152: X108.2 X108.1
N108_05
  Top 0.152: X108.6 X108.5
N108_15
  Top 0.152: X108.16 X108.15
N110_01
  Top 0.152: X110.2 X110.1
N110_03
  Top 0.152: X110.4 X110.3
N110_05
  Top 0.152: X110.6 X110.5
N110_07
  Top 0.152: X110.8 X110.7
N110_09
  Top 0.152: X110.10 X110.9
N110_11
  Top 0.152: X110.12 X110.11
N110_17
  Top 0.152: X110.18 X110.17
N110_19
  Top 0.152: X110.20 X110.19
N110_21
  Top 0.152: X110.22 X110.21
N110_23
  Top 0.152: X110.24 X110.23
P00  (via drill 0.3)
  Top 0.152: X190.28 X190.27 | v43.15,4.12 43.15,3.52 43.86,2.81 arc45 44.08,2.72 48.35,2.72 arc45 48.57,2.81 49.48,3.72 X190.27 | X301.7 79.32,24.82 arc-45 79.5,24.38 79.5,19.44 arc-45 79.32,18.99 v78.74,18.41 | v64.14,3.81 63.05,2.73 arc-45 62.6,2.54 51.06,2.54 arc-45 50.61,2.73 X190.27
  Bottom 0.152: v43.15,4.12 42.43,4.84 arc45 42.21,4.93 41.87,4.93 arc-45 41.64,5.02 40.82,5.84 arc-45 40.73,6.07 40.73,49.77 arc-45 40.82,49.99 43.96,53.12 arc-45 44.18,53.22 44.72,53.22 arc-45 44.95,53.12 45.87,52.2 arc45 46.09,52.11 46.97,52.11 X201.24 | v78.74,18.41 v64.14,3.81
P01  (via drill 0.3)
  Top 0.152: X190.30 X190.29 | v55.42,30.58 54.51,31.5 arc-45 54.41,31.72 54.41,41.01 arc45 54.32,41.24 47.16,48.4 arc-45 47.07,48.62 47.07,49.49 X201.26
  Bottom 0.152: v55.42,30.58 55.42,26.39 arc-45 55.33,26.16 52.19,23.03 arc45 52.1,22.8 52.1,6.44 X190.30 arc45 52.16,6.13 53.34,4.95 63.11,4.95 arc45 63.56,5.14 77.54,19.12 arc-45 77.99,19.3 79.12,19.3 arc90 79.5,19.68 79.5,25.64 arc45 79.32,26.09 X301.9
P02  (via drill 0.3)
  Top 0.152: X190.32 X190.31 | v50.8,30.48 50.8,21.85 arc45 50.99,21.4 v54.61,17.78 61.28,17.78 65.09,21.59 65.09,60.96 60.64,60.96 51.12,70.48 51.12,71.12 46.67,71.12 45.72,70.17 45.72,68.58 X201.12 | v50.61,38.29 X201.32
  Bottom 0.152: X301.11 78.29,27.49 arc-45 77.84,27.3 76.33,27.3 arc90 75.69,26.67 75.69,23.5 arc-45 75.51,23.05 61.34,8.89 arc-45 61.03,8.76 55.24,8.76 arc90 54.61,8.13 X190.32 v54.61,17.78 | v50.61,38.29 arc-45 50.8,37.84 v50.8,30.48
P03  (via drill 0.3)
  Top 0.152: X190.33 57.13,3.82 57.13,6.34 X190.34 v64.77,13.97
  Bottom 0.152: X201.33 44.35,39.34 44.35,38.46 arc-45 44.26,38.24 43.14,37.11 arc45 43.05,36.89 43.05,6.14 44.16,5.02 arc45 44.38,4.93 47.34,4.93 arc-45 47.56,4.84 48.28,4.12 arc-45 48.38,3.89 48.38,3.55 arc45 48.47,3.33 48.99,2.81 arc45 49.21,2.72 55.99,2.72 arc45 56.22,2.81 57.13,3.72 X190.33 | X301.13 78.29,28.76 arc-45 77.84,28.57 76.07,28.57 73.85,26.35 arc45 73.66,25.9 73.66,23.12 arc-45 73.47,22.67 v64.77,13.97
PI_11
  Top 0.152: X105.17 X105.18 12.77,36.92 43.05,67.21 arc-45 43.28,67.3 44.35,67.3 X201.11
PI_13
  Top 0.152: X105.19 X105.20 12.77,34.3 43.05,64.59 arc-45 43.28,64.69 44.35,64.69 X201.13
PI_15
  Top 0.152: X105.21 X105.22 12.77,31.79 14.98,31.79 44.26,61.07 arc45 44.35,61.3 44.35,62.17 X201.15
PI_16
  Top 0.152: X110.26 X110.25 60.95,31.79 59.94,32.8 arc-45 59.84,33.03 59.84,42.65 55.31,47.19 arc-45 55.22,47.41 55.22,52.88 arc45 55.12,53.11 47.16,61.07 arc-45 47.07,61.3 47.07,62.17 X201.16
PI_18
  Top 0.152: X110.28 X110.27 60.95,29.27 54.91,35.32 arc-45 54.81,35.54 54.81,50.77 arc45 54.72,51 47.16,58.56 arc-45 47.07,58.78 47.07,59.66 X201.18
PI_22  (via drill 0.3)
  Top 0.152: X110.29 X110.30 63.55,26.74 arc-8 63.58,26.77 64.58,27.77 arc45 64.67,28 64.67,29.45 arc45 64.58,29.67 63.96,30.29 arc45 63.74,30.38 60.88,30.38 arc-45 60.66,30.47 56.62,34.51 arc-45 56.53,34.74 v56.53,45.07
  Bottom 0.152: v56.53,45.07 47.07,54.52 X201.22
PI_27
  Top 0.152: X105.23 X105.24 12.77,29.27 13.07,29.27 30.68,46.89 arc-45 30.9,46.98 44.35,46.98 X201.27
PI_28
  Top 0.152: X110.32 X110.31 60.95,24.14 54.1,30.99 arc-45 54.01,31.22 54.01,38.9 arc45 53.92,39.13 47.16,45.88 arc-45 47.07,46.11 47.07,46.98 X201.28
PI_29
  Top 0.152: X105.25 X105.26 12.77,26.76 30.28,44.27 arc-45 30.5,44.37 44.35,44.37 X201.29
PI_31
  Top 0.152: X105.27 X105.28 12.77,24.14 30.38,41.76 arc-45 30.6,41.85 44.35,41.85 X201.31
PI_36
  Top 0.152: X110.34 X110.33 60.95,21.63 56.56,21.63 arc-45 56.33,21.72 53.9,24.15 arc-45 53.81,24.38 53.81,28.94 arc45 53.72,29.17 47.16,35.72 arc-45 47.07,35.95 47.07,36.82 X201.36
PI_37
  Top 0.152: X105.29 X105.30 12.77,21.63 15.55,21.63 arc45 15.78,21.72 28.16,34.11 arc-45 28.39,34.2 44.35,34.2 X201.37
SPI_MISO_OUT
  Top 0.152: R107.2 72.02,57.24 arc45 72.24,57.15 X302.12
SPI_MISO_OUT_R  (via drill 0.3)
  Top 0.152: X107.11 X107.12 63.57,76.15 70.11,69.61 arc-45 70.21,69.38 70.21,64.77 | X201.35 44.45,36.92 44.45,37.83 45.47,38.84 arc45 45.56,39.06 45.56,53.29 arc45 45.47,53.51 44.51,54.47 arc-43 X201.21 44.45,54.63 44.45,55.4 arc-45 44.55,55.62 45.86,56.94 45.86,62.54 arc-45 45.95,62.77 46.47,63.28 arc-45 46.7,63.38 v51.3,63.38 arc-90 v51.31,63.37 | 70.21,64.77 70.21,57.24 R107.1 | v67.31,64.77 70.21,64.77
  Bottom 0.152: v51.31,63.37 65.65,63.37 arc45 66.1,63.56 v67.31,64.77
SPI_MOSI_IN  (via drill 0.3)
  Top 0.152: v44.76,50.8 44.28,50.8 arc-45 44.06,50.9 43.44,51.52 arc-45 43.35,51.74 43.35,56 arc-45 43.44,56.23 44.35,57.14 X201.19 | v42.95,60.66 42.95,62.14 arc-45 43.04,62.36 43.96,63.28 arc-45 44.18,63.38 44.52,63.38 arc45 44.75,63.47 45.47,64.19 arc45 45.56,64.42 45.56,64.75 arc-45 45.65,64.98 46.47,65.8 arc-45 46.7,65.89 50.16,65.89 arc45 50.38,65.99 52.06,67.66 arc45 v52.07,67.69 | 65.66,75.69 65.75,75.6 | 65.75,75.6 72.2,69.15 arc-45 72.39,68.7 v72.39,59.69 | 65.75,75.6 65.72,75.56 v65.68,75.65
  Bottom 0.152: v65.68,75.65 65.48,75.65 63.57,73.74 X107.14 X107.13 58.3,73.66 arc45 57.85,73.47 v52.07,67.69 | v44.76,50.8 45.47,50.09 arc-45 45.56,49.87 45.56,36.85 arc45 45.65,36.63 46.88,35.4 arc-45 46.97,35.18 46.97,34.3 X201.38 | v42.95,60.66 42.95,58.78 arc45 43.04,58.56 44.35,57.24 X201.19 | v72.39,59.69 75.69,59.69 arc-90 76.07,59.31 76.07,58.29 76.39,57.97 arc45 76.84,57.78 78.23,57.78 78.65,57.37 arc-45 X302.11
SPI_SCK_IN  (via drill 0.3)
  Top 0.152: X107.9 61.05,78.77 63.47,78.77 X107.10 | X302.13 arc-90 78.11,57.78 74.3,57.78 arc-90 v73.66,58.42 73.66,72.39 67.57,78.48 arc45 67.12,78.67 66.11,78.67 arc-90 v66.04,78.74
  Bottom 0.152: 48.18,44.37 48.18,49.77 arc45 48.08,49.99 47.26,50.81 arc45 47.04,50.9 45.69,50.9 arc-45 45.47,51 44.45,52.01 X201.23 | 48.18,44.37 48.18,33.9 47.07,32.8 47.07,31.79 X201.40 | 48.18,44.37 59.11,44.37 arc45 59.34,44.46 60.66,45.78 arc-45 60.88,45.87 73.03,45.87 arc90 73.66,46.51 v73.66,58.42 | v66.04,78.74 X107.10
TIMCAP_OUT  (via drill 0.3)
  Top 0.152: X190.16 X190.15 36.14,1.96 arc45 36.59,1.78 64.51,1.78 arc45 64.96,1.96 65.98,2.99 arc45 66.17,3.44 66.17,14.47 arc-45 66.35,14.92 71.06,19.63 arc45 71.25,20.07 v71.25,21.84 | X301.31 arc-90 78.11,40.01 75.56,40.01 arc90 74.42,38.86 v74.42,28.57
  Bottom 0.152: v71.25,21.84 71.25,25.14 arc-45 71.43,25.59 v74.42,28.57
WAKEUP_OUT  (via drill 0.3)
  Top 0.152: X190.18 X190.17 38.3,2.35 arc45 38.74,2.16 64.01,2.16 arc45 64.22,2.25 65.47,3.5 arc45 65.66,3.95 65.66,14.85 arc-45 65.84,15.3 70.43,19.88 arc45 70.61,20.33 v70.61,22.86 | X301.33 arc-90 78.11,41.27 75.56,41.27 arc90 73.91,39.62 73.91,29.21 v73.79,29.34
  Bottom 0.152: v70.61,22.86 70.61,25.9 arc-45 70.8,26.35 v73.79,29.34

### Text on the board
tPlace: TOP of Ard. | HFT-ArduinoShield-Module V1.1 / (C) 2018 by Institut für HFT, / Hochschule Mannheim, Germany | D15 | D14 | TOP of Ard. | TOP of Pi | GND | +3V3 | +5V0 | +5V0 | D13 | +3V3 | GPIO02 | +5V0 | D12 | GPIO03 | GPIO03 | GND | GND | D11 | +3V3 | GPIO14 | D10 | +5V0 | GPIO15 | GND | D9 | GND | PI_11 | GPIO18 | D8 | GND | PI_13 | GND | PI_15 | PI_16 | D7 | +3V3 | PI_18 | PWM_1 | D6 | A0 | USART_B_SCLK | GPIO10 | GND | PWM_2 | D5 | A1 | USART_B_RX | GPIO09 | PI_22 | D4 | A2 | USART_B_TX | GPIO11 | GPIO11 | GPIO08 | PWM_3 | D3 | A3 | USART_B_RTS | GND | GPIO07 | D2 | A4 | USART_B_CTS | PI_27 | UART_A_TX | D1 | PI_28 | A5 | PI_29 | UART_A_RX | D0 | GND | PI_31 | GPIO12 | GPIO13 | GND | PI_11 | GPIO19 | PI_36 | PI_13 | PI_37 | GPIO20 | PI_15 | GND | GPIO21 | PI_16 | PI_27 | PI_18 | PI_29 | PI_22 | PI_31 | PI_28 | PI_37 | PI_36 | PI socket <--> Arduino sockets / interconnect: PI_xx | +3V3 | +5V0 | GND | CLK_IN_P | CLK_IN_N | GND | EVENT_IN | TIMECAP_OUT | WAKEUP_OUT | DCE_TX_OUT | DCE_RX_IN | DCE_CTS_OUT | DCE_RTS_IN | P00_INOUT | P01_INOUT | P02_INOUT | P03_INOUT
tDocu: poly <--> edge: 12.5 mil / socket <--> edge: 50.0 mil | 4x 2.8 mm